# EAGLE design V2a (EAGLE 6.5.0)
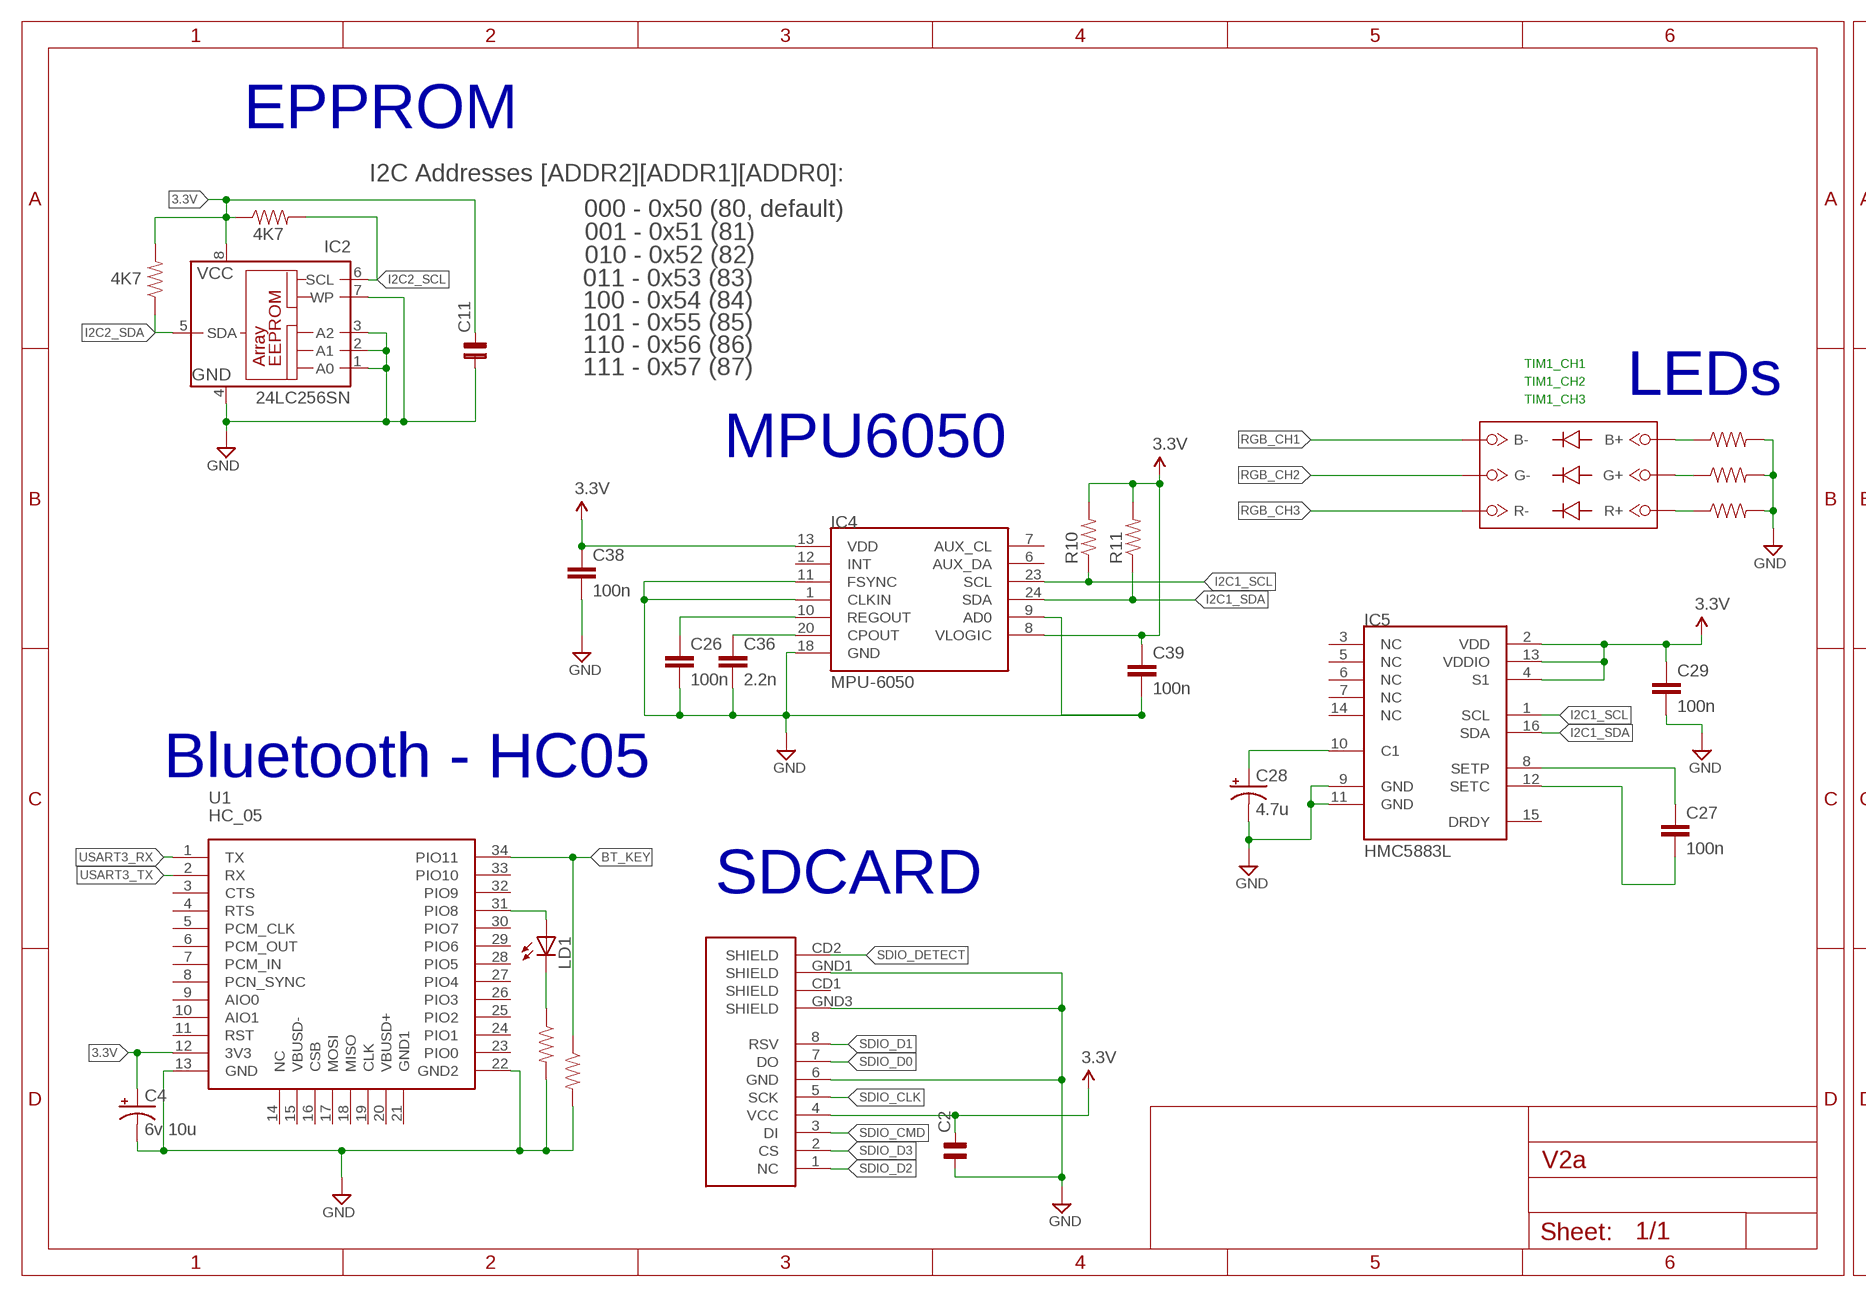
[diagram p0: schematic, sheet 1, part 1 of 2]
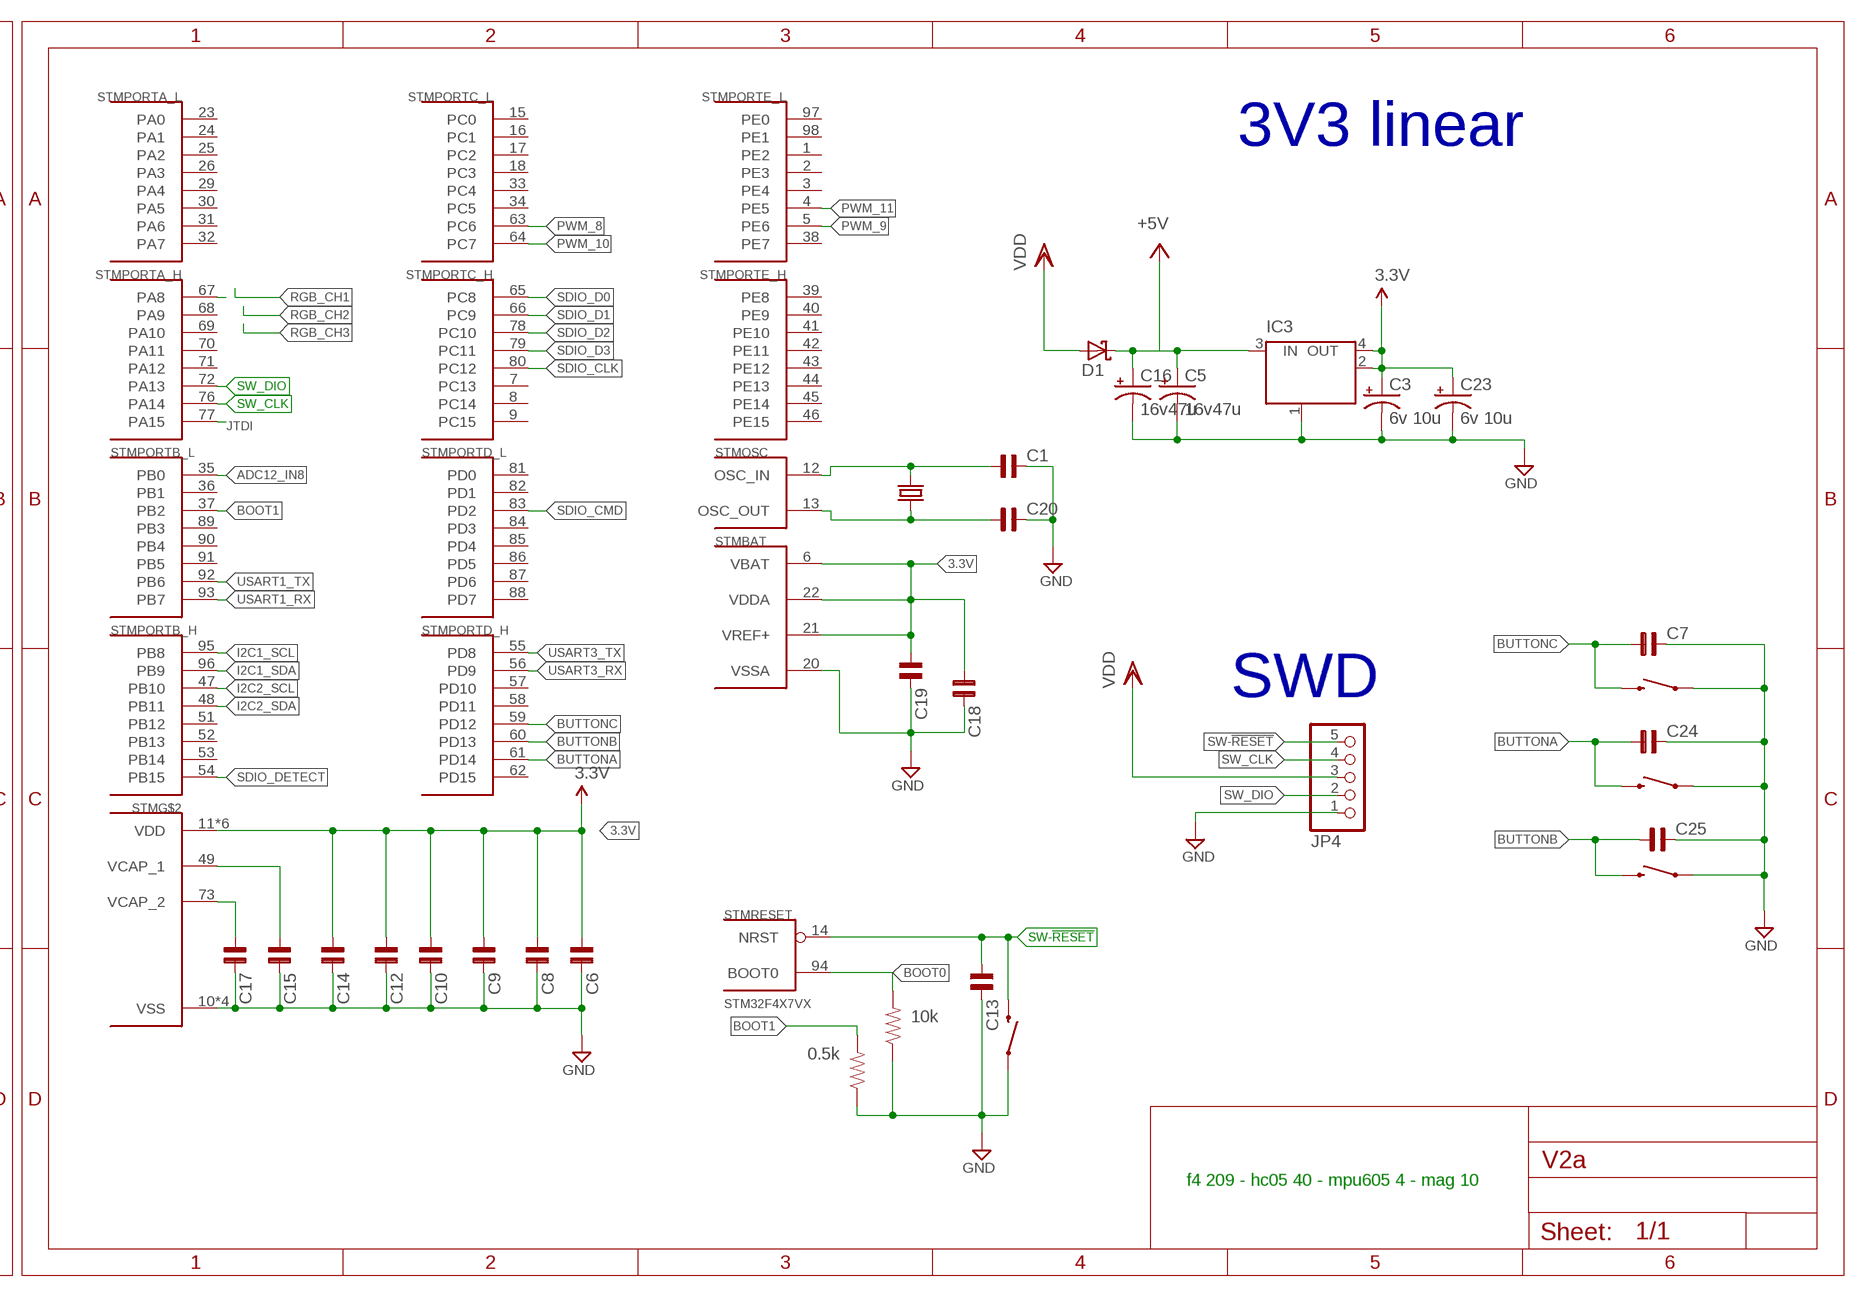
[diagram p1: schematic, sheet 1, part 2 of 2]

## Parts
C1  C-NP-SMD-0603  [C-0603]
C2  C-NP-SMD-0603  [C-0603]
C3  6v 10u  CPOL-USSMCC  [SMC_C]
C4  6v 10u  CPOL-USSMCA  [SMC_A]
C5  16v47u  CPOL-USSMCC  [SMC_C]
C6  C-NP-SMD-0603  [C-0603]
C7  C-NP-SMD-0603  [C-0603]
C8  C-NP-SMD-0603  [C-0603]
C9  C-NP-SMD-0603  [C-0603]
C10  C-NP-SMD-0603  [C-0603]
C11  C-NP-SMD-0603  [C-0603]
C12  C-NP-SMD-0603  [C-0603]
C13  C-NP-SMD-0603  [C-0603]
C14  C-NP-SMD-0603  [C-0603]
C15  C-NP-SMD-0603  [C-0603]
C16  16v47u  CPOL-USSMCC  [SMC_C]
C17  C-NP-SMD-0603  [C-0603]
C18  C-NP-SMD-0603  [C-0603]
C19  C-NP-SMD-0603  [C-0603]
C20  C-NP-SMD-0603  [C-0603]
C23  6v 10u  CPOL-USSMCC  [SMC_C]
C24  C-NP-SMD-0603  [C-0603]
C25  C-NP-SMD-0603  [C-0603]
C26  100n  SPARKFUN_CAP0603-CAP  [SPARKFUN_0603-CAP]
C27  100n  SPARKFUN_CAP0603-CAP  [SPARKFUN_0603-CAP]
C28  4.7u  CPOL-USSMCA  [SMC_A]
C29  100n  SPARKFUN_CAP0603-CAP  [SPARKFUN_0603-CAP]
C36  2.2n  SPARKFUN_CAP0603-CAP  [SPARKFUN_0603-CAP]
C38  100n  SPARKFUN_CAP0603-CAP  [SPARKFUN_0603-CAP]
C39  100n  SPARKFUN_CAP0603-CAP  [SPARKFUN_0603-CAP]
D1  MBRS330T3  [SMC]
IC2  24LC256SN  [SO-08]
IC3  LINEAR_MC33269ST-3.3T3  [LINEAR_SOT223]
IC4  MPU-6050  TESTING_MPU-6050-1  [TESTING_QFN-24-4MM2]
IC5  HMC5883L  SPARKFUN_HMC5883LSMD  [SPARKFUN_16LPCC]
JP4  PINHD-1X5_2.54-90°  [1X05/90]
LD1  LEDCHIPLED_0603  [CHIPLED_0603]
R2  10K  SPARKFUN_RESISTOR0603-RES  [SPARKFUN_0603-RES]
R3  10K  SPARKFUN_RESISTOR0603-RES  [SPARKFUN_0603-RES]
R5  10K  SPARKFUN_RESISTOR0603-RES  [SPARKFUN_0603-RES]
R6  10K  SPARKFUN_RESISTOR0603-RES  [SPARKFUN_0603-RES]
R7  10k  SPARKFUN_RESISTOR0603-RES  [SPARKFUN_0603-RES]
R8  0.5k  SPARKFUN_RESISTOR0603-RES  [SPARKFUN_0603-RES]
R9  10K  SPARKFUN_RESISTOR0603-RES  [SPARKFUN_0603-RES]
R10  SPARKFUN_RESISTOR0603-RES  [SPARKFUN_0603-RES]
R11  SPARKFUN_RESISTOR0603-RES  [SPARKFUN_0603-RES]
R15  4K7  SPARKFUN_RESISTOR0603-RES  [SPARKFUN_0603-RES]
R16  4K7  SPARKFUN_RESISTOR0603-RES  [SPARKFUN_0603-RES]
S1  RESET  SWITCH-MOMENTARY-2-SMD-1101NE  [TACTILE-SWITCH-1101NE]
S2  RESET  SWITCH-MOMENTARY-2-SMD-1101NE  [TACTILE-SWITCH-1101NE]
S3  RESET  SWITCH-MOMENTARY-2-SMD-1101NE  [TACTILE-SWITCH-1101NE]
S4  RESET  SWITCH-MOMENTARY-2-SMD-1101NE  [TACTILE-SWITCH-1101NE]
SDCARD2  microSD Socket  USD-SOCKETNEW  [MICRO-SD-SOCKET-PP]
STM  STM32F4X7VX  [TQFP100]
U1  HC_05  [BLUETOOTH_SMD]
U$12  RGB_LED  [SMD]
Y1  CRYSTALHC49US  [HC49US]

## Nets
3.3V: C2.2 C3.+ C4.+ C6.1 C8.1 C9.1 C10.1 C11.2 C12.1 C14.1 C18.1 C19.1 C23.+ C29.1 C38.1 C39.1 IC2.8(VCC) IC3.2(OUT) IC3.4(OUT) IC4.8(VLOGIC) IC4.13(VDD) IC5.2(VDD) IC5.4(S1) IC5.13(VDDIO) R10.2 R11.2 R15.1 R16.2 SDCARD2.4(VCC) STM.6(BAT:VBAT) STM.11(VDD) STM.19(VDD) STM.21(BAT:VREF+) STM.22(BAT:VDDA) STM.28(VDD) STM.50(VDD) STM.75(VDD) STM.100(VDD) U1.12(3V3)
+5V: C5.+ C16.+ D1.C IC3.3(IN)
ADC12_IN8: STM.35(PORTB_L:PB0)
BOOT0: R7.2 STM.94(RESET:BOOT0)
BOOT1: R8.2 STM.37(PORTB_L:PB2)
BT_KEY: R5.1 U1.34(PIO11)
BUTTONA: C24.1 S3.P$2 STM.61(PORTD_H:PD14)
BUTTONB: C25.1 S2.P$2 STM.60(PORTD_H:PD13)
BUTTONC: C7.1 S4.P$2 STM.59(PORTD_H:PD12)
GND: C1.2 C2.1 C3.- C4.- C5.- C6.2 C7.2 C8.2 C9.2 C10.2 C11.1 C12.2 C13.2 C14.2 C15.2 C16.- C17.2 C18.2 C19.2 C20.2 C23.- C24.2 C25.2 C26.2 C28.- C29.2 C36.2 C38.2 C39.2 IC2.1(A0) IC2.2(A1) IC2.3(A2) IC2.4(GND) IC2.7(WP) IC3.1(GND/ADJ) IC4.1(CLKIN) IC4.9(AD0) IC4.11(FSYNC) IC4.18(GND) IC5.9(GND) IC5.11(GND) JP4.1 R2.2 R3.2 R5.2 R6.2 R7.1 R8.1 R9.2 S1.P$1 S2.P$1 S3.P$1 S4.P$1 SDCARD2.6(GND) SDCARD2.GND1(SHIELD) SDCARD2.GND3(SHIELD) STM.10(VSS) STM.20(BAT:VSSA) STM.27(VSS) STM.74(VSS) STM.99(VSS) U1.13(GND) U1.22(GND2)
I2C1_SCL: IC4.23(SCL) IC5.1(SCL) R10.1 STM.95(PORTB_H:PB8)
I2C1_SDA: IC4.24(SDA) IC5.16(SDA) R11.1 STM.96(PORTB_H:PB9)
I2C2_SCL: IC2.6(SCL) R15.2 STM.47(PORTB_H:PB10)
I2C2_SDA: IC2.5(SDA) R16.1 STM.48(PORTB_H:PB11)
JTDI: STM.77(PORTA_H:PA15)
N$1: C1.1 STM.12(OSC:OSC_IN) Y1.2
N$2: R2.1 U$12.B+
N$3: C26.1 IC4.10(REGOUT)
N$4: LD1.A U1.31(PIO8)
N$5: LD1.C R9.1
N$6: R6.1 U$12.R+
N$7: R3.1 U$12.G+
N$8: C36.1 IC4.20(CPOUT)
N$10: C27.1 IC5.8(SETP)
N$11: STM.67(PORTA_H:PA8)
N$12: C28.+ IC5.10(C1)
N$13: C27.2 IC5.12(SETC)
N$29: C20.1 STM.13(OSC:OSC_OUT) Y1.1
N$31: C17.1 STM.73(VCAP_2)
N$32: C15.1 STM.49(VCAP_1)
PWM_8: STM.63(PORTC_L:PC6)
PWM_9: STM.5(PORTE_L:PE6)
PWM_10: STM.64(PORTC_L:PC7)
PWM_11: STM.4(PORTE_L:PE5)
RGB_CH1: U$12.B-
RGB_CH2: U$12.G-
RGB_CH3: U$12.R-
SDIO_CLK: SDCARD2.5(SCK) STM.80(PORTC_H:PC12)
SDIO_CMD: SDCARD2.3(DI) STM.83(PORTD_L:PD2)
SDIO_D0: SDCARD2.7(DO) STM.65(PORTC_H:PC8)
SDIO_D1: SDCARD2.8(RSV) STM.66(PORTC_H:PC9)
SDIO_D2: SDCARD2.1(NC) STM.78(PORTC_H:PC10)
SDIO_D3: SDCARD2.2(CS) STM.79(PORTC_H:PC11)
SDIO_DETECT: SDCARD2.CD2(SHIELD) STM.54(PORTB_H:PB15)
SW-!RESET: C13.1 JP4.5 S1.P$2 STM.14(RESET:NRST)
SW_CLK: JP4.4 STM.76(PORTA_H:PA14)
SW_DIO: JP4.2 STM.72(PORTA_H:PA13)
USART1_RX: STM.93(PORTB_L:PB7)
USART1_TX: STM.92(PORTB_L:PB6)
USART3_RX: STM.56(PORTD_H:PD9) U1.1(TX)
USART3_TX: STM.55(PORTD_H:PD8) U1.2(RX)
VDD: D1.A JP4.3
Unconnected: IC4.6(AUX_DA) IC4.7(AUX_CL) IC4.12(INT) IC5.3(NC) IC5.5(NC) IC5.6(NC) IC5.7(NC) IC5.14(NC) IC5.15(DRDY) SDCARD2.CD1(SHIELD) STM.1(PORTE_L:PE2) STM.2(PORTE_L:PE3) STM.3(PORTE_L:PE4) STM.7(PORTC_H:PC13) STM.8(PORTC_H:PC14) STM.9(PORTC_H:PC15) STM.15(PORTC_L:PC0) STM.16(PORTC_L:PC1) STM.17(PORTC_L:PC2) STM.18(PORTC_L:PC3) STM.23(PORTA_L:PA0) STM.24(PORTA_L:PA1) STM.25(PORTA_L:PA2) STM.26(PORTA_L:PA3) STM.29(PORTA_L:PA4) STM.30(PORTA_L:PA5) STM.31(PORTA_L:PA6) STM.32(PORTA_L:PA7) STM.33(PORTC_L:PC4) STM.34(PORTC_L:PC5) STM.36(PORTB_L:PB1) STM.38(PORTE_L:PE7) STM.39(PORTE_H:PE8) STM.40(PORTE_H:PE9) STM.41(PORTE_H:PE10) STM.42(PORTE_H:PE11) STM.43(PORTE_H:PE12) STM.44(PORTE_H:PE13) STM.45(PORTE_H:PE14) STM.46(PORTE_H:PE15) STM.51(PORTB_H:PB12) STM.52(PORTB_H:PB13) STM.53(PORTB_H:PB14) STM.57(PORTD_H:PD10) STM.58(PORTD_H:PD11) STM.62(PORTD_H:PD15) STM.68(PORTA_H:PA9) STM.69(PORTA_H:PA10) STM.70(PORTA_H:PA11) STM.71(PORTA_H:PA12) STM.81(PORTD_L:PD0) STM.82(PORTD_L:PD1) STM.84(PORTD_L:PD3) STM.85(PORTD_L:PD4) STM.86(PORTD_L:PD5) STM.87(PORTD_L:PD6) STM.88(PORTD_L:PD7) STM.89(PORTB_L:PB3) STM.90(PORTB_L:PB4) STM.91(PORTB_L:PB5) STM.97(PORTE_L:PE0) STM.98(PORTE_L:PE1) U1.3(CTS) U1.4(RTS) U1.5(PCM_CLK) U1.6(PCM_OUT) U1.7(PCM_IN) U1.8(PCN_SYNC) U1.9(AIO0) U1.10(AIO1) U1.11(RST) U1.14(NC) U1.15(VBUSD-) U1.16(CSB) U1.17(MOSI) U1.18(MISO) U1.19(CLK) U1.20(VBUSD+) U1.21(GND1) U1.23(PIO0) U1.24(PIO1) U1.25(PIO2) U1.26(PIO3) U1.27(PIO4) U1.28(PIO5) U1.29(PIO6) U1.30(PIO7) U1.32(PIO9) U1.33(PIO10)

## Notes on the sheet
- EPPROM | 3V3 linear
- I2C Addresses [ADDR2][ADDR1][ADDR0]:
- 000 - 0x50 (80, default)
- 001 - 0x51 (81)
- 010 - 0x52 (82)
- 011 - 0x53 (83)
- 100 - 0x54 (84)
- 101 - 0x55 (85)
- 110 - 0x56 (86)
- TIM1_CH1
- 111 - 0x57 (87)
- TIM1_CH2
- LEDs
- TIM1_CH3
- MPU6050
- SWD
- Bluetooth - HC05
- SDCARD
- f4 209 - hc05 40 - mpu605 4 - mag 10
- TJA1040

## Library data of the parts
C1 C2 C6-C15 C17-C20 C24 C25 = cap-pan40:C-NP: NON-POLARIZED FILM/CHIP
C3-C5 C16 C23 C28 = rcl:CPOL-US: POLARIZED CAPACITOR, American symbol
C26 C27 C29 C36 C38 C39 = Helios_RLC:SPARKFUN_CAP: Capacitor Standard 0603 ceramic capacitor, and 0.1" leaded capacitor.
D1 = Robotech Diode of Chung:MBRS3*0T3: SCHOTTKY BARRIER RECTIFIER 3.0 AMPERES 20, 30, 40 VOLT Source: MBRS340T3-D.pdf
IC2 = microchip:24*: Serial EEPROM I2C; DIGIKEY: 24LC256-E/SN-ND; MF: MICROCHIP; MPN: 24LC256-I/SN; OC_FARNELL: 9757996; OC_NEWARK: 27C9144
IC3 = Robotech_Other:LINEAR_MC33269ST*: Adjustable Output Low Dropout Voltage Regulator 800 mA Source: http://www.onsemi.com/pub/Collateral/MC33269-D.PDF
IC4 = Helios_IMU:TESTING_MPU-6050
IC5 = Helios_IMU:SPARKFUN_HMC5883L: 3 Axis Digital Compass IC
JP4 = pinhead-1:PINHD-1X5: PIN HEADER
LD1 = led:LED: LED OSRAM: - CHIPLED LG R971, LG N971, LY N971, LG Q971, LY Q971, LO R971, LY R971 LH N974, LH R974 LS Q976, LO Q976, LY Q976 LO Q996 - Hyper CHIPLED LW Q18S LB Q993, LB Q99A, LB R99A - SideLED LS A670, LO A670, LY A670, LG A670, LP A670 LB A673, LV A673, LT A673, LW A673 LH A674 LY A675 LS A676, LA A676, LO A676, LY A676, LW A676 LS A679, LY A679, LG A679 - Hyper Micro SIDELED® LS Y876, LA Y876, LO Y876, LY Y876 LT Y87S - SmartLED LW L88C, LW L88S LB L89C, LB L89S, LG L890 LS L89K, LO L89K, LY L89K LS L896, LA L896, LO L896, LY L896 - TOPLED LS T670, LO T670, LY T670, LG T670, LP T670 LSG T670, LSP T670, LSY T670, LOP T670, LYG T670 LG T671, LOG T671, LSG T671 LB T673, LV T673, LT T673, LW T673 LH T674 LS T676, LA T676, LO T676, LY T676, LB T676, LH T676, LSB T676, LW T676 LB T67C, LV T67C, LT T67C, LS T67K, LO T67K, LY T67K, LW E67C LS E67B, LA E67B, LO E67B, LY E67B, LB E67C, LV E67C, LT E67C LW T67C LS T679, LY T679, LG T679 LS T770, LO T770, LY T770, LG T770, LP T770 LB T773, LV T773, LT T773, LW T773 LH T774 LS E675, LA E675, LY E675, LS T675 LS T776, LA T776, LO T776, LY T776, LB T776 LHGB T686 LT T68C, LB T68C - Hyper Mini TOPLED® LB M676 - Mini TOPLED Santana® LG M470 LS M47K, LO M47K, LY M47K Source: http://www.osram.convergy.de/
R2 R3 R5-R9 R15 R16 = Robotech_RCL:SPARKFUN_RESISTOR: Resistor Basic schematic elements and footprints for 0603, 1206, and PTH resistors.
R10 R11 = Helios_RLC:SPARKFUN_RESISTOR: Resistor Basic schematic elements and footprints for 0603, 1206, and PTH resistors.
S1-S4 = pixhawk2:SWITCH-MOMENTARY-2; PARTNO: EVQ-P7J01P
SDCARD2 = SparkFun:USD-SOCKET: microSD Socket Push-push type uSD socket. Schematic element and footprint production proven. Spark Fun Electronics SKU : PRT-00127. tDoc lines correctly indicate media card edge positions when inserting (unlocked, locked, depressed).
STM = pixhawk2:STM32F4X7VX: STM32F4X7VX 100 pin LQFP STM32F407VE - 512 KB flash, no crypto STM32F407VG - 1 MB flash, no crypto STM32F417VE - 512 KB flash, with crypto STM32F417VG - 1 MB flash, with crypto; PARTNO: STM32F427VI
U1 = SerialPortBluetooth:HC_05
U$12 = RGB_LED:RGB_LED
Y1 = SparkFun-FreqCtrl:CRYSTAL: Various standard crystals. Proven footprints. Spark Fun Electronics SKU : COM-00534

## Net classes
1 power: width 0.15 mm, drill 0.2 mm, clearance 0.152 mm

## Board
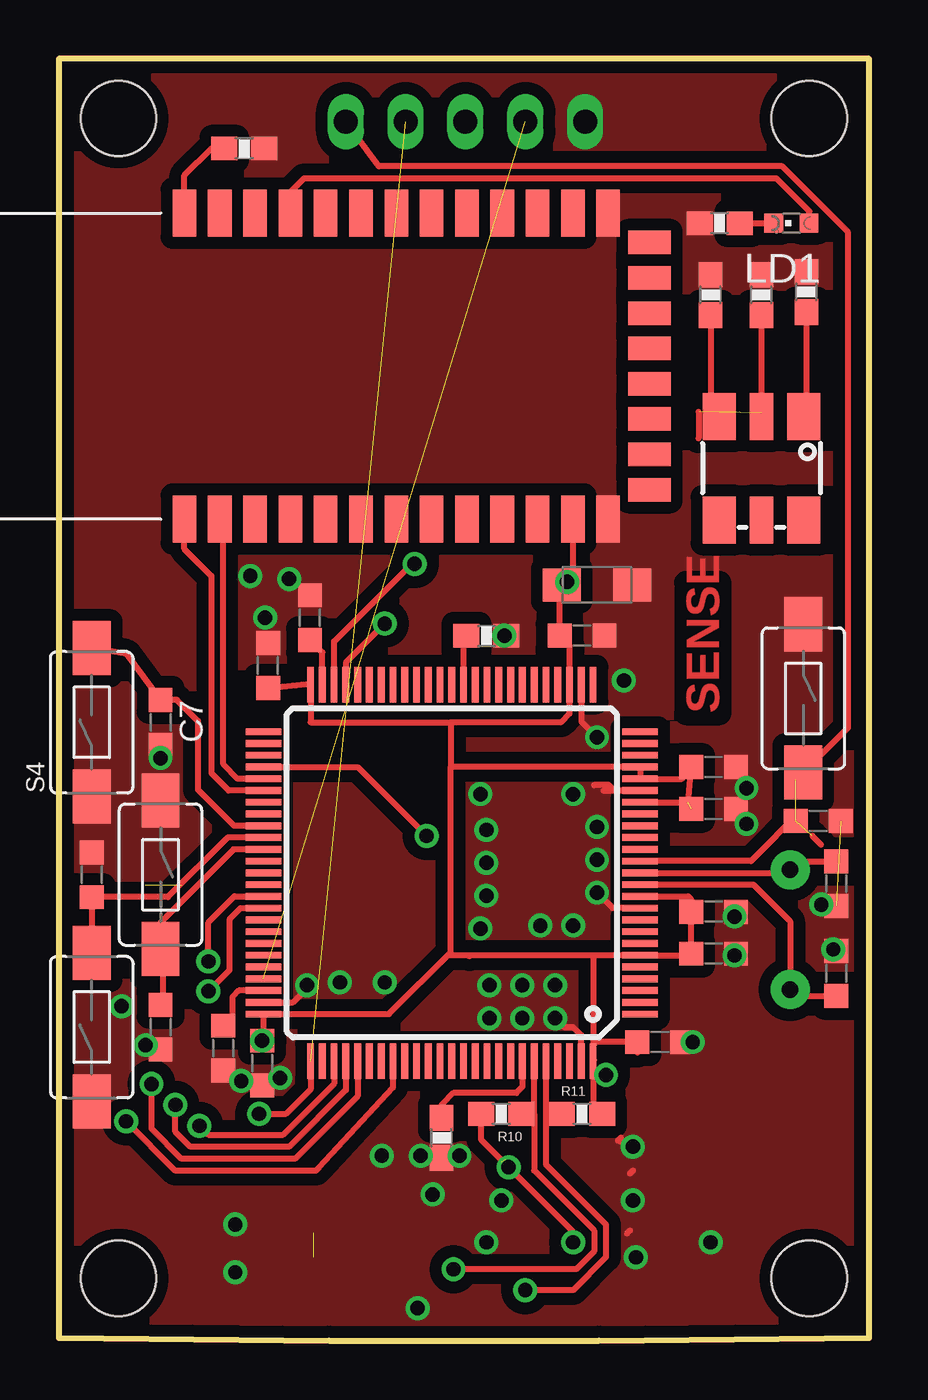
[diagram p2: board, top side]
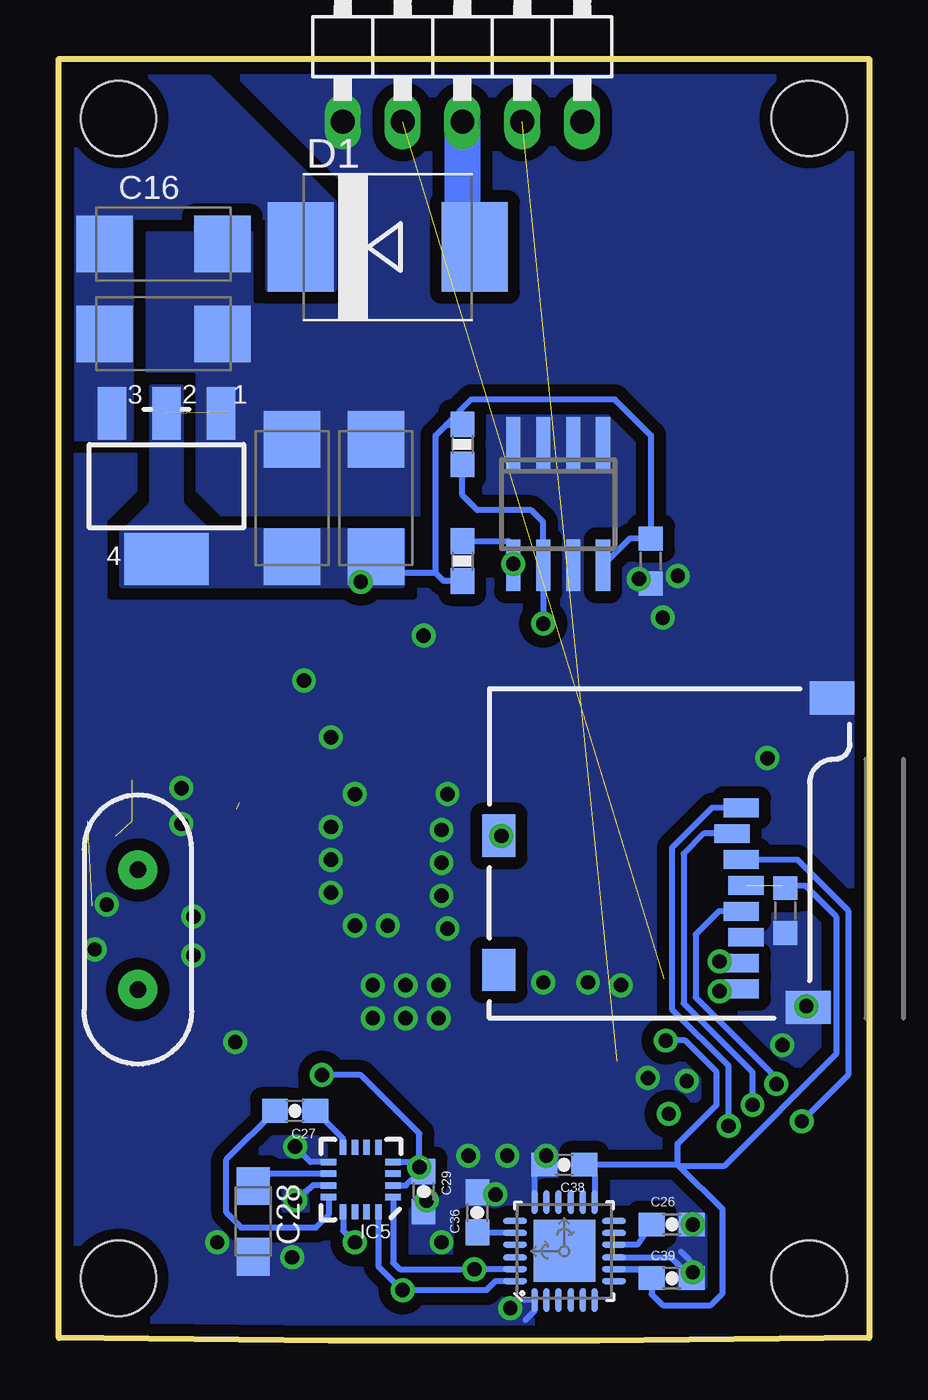
[diagram p3: board, bottom side, seen from below]

Size 34.42 x 54.47 mm. Coordinates in mm from the lower left corner, seen from the top.
Outline: 34.42,54.47 0,54.47 0,0.11 arc2 34.42,0.11 34.42,54.47
Copper layers (1*16): Top 0.035mm / dielectric 1.5mm / Bottom 0.035mm
Design rules "default *": minimum track width 10mil, minimum drill 24mil, track to track 8mil, track to pad 8mil, pad to pad 8mil, via to via 10mil, smd to smd 8mil, copper to edge 20mil, drill to drill 10mil, minimum pad ring 10mil, minimum via ring 8mil, stop-mask expansion 0mil, vias tented up to drill 100mil, thermal gap 10mil
Holes 3.2 mm at 2.54,51.93 31.88,2.65 2.54,2.65 31.88,51.93
tKeepout: area 28.4,-0.8 to 35.4,6.2; area -1,48.4 to 6,55.4; area 28.4,48.4 to 35.4,55.4; area -1,-0.8 to 6,6.2

### Footprints (pad centres in the part's own frame; a part is rotated, then mirrored left to right if it is on the bottom)
C-0603 = smd 1.016 x 1.016: 1 -0.953,0; 2 0.953,0
SMC_C = smd 2.4 x 2.4: + -2.5,0; - 2.5,0
SMC_A = smd 1.6 x 1.4: + -1.5,0; - 1.5,0
SPARKFUN_0603-CAP = smd 1.1 x 1: 1 -0.85,0; 2 0.85,0
SMC = smd 2.8 x 3.8: A 3.7,0; C -3.7,0
SO-08 = smd 0.6 x 2.2: 1 -1.905,-2.6; 2 -0.635,-2.6; 3 0.635,-2.6; 4 1.905,-2.6; 5 1.905,2.6; 6 0.635,2.6; 7 -0.635,2.6; 8 -1.905,2.6
LINEAR_SOT223 = smd 1.219 x 2.235: 1 -2.311,-3.099; 2 0,-3.099; 3 2.311,-3.099 | smd 3.6 x 2.2: 4 0,3.099
TESTING_QFN-24-4MM2 = smd 1.016 x 0.254: 1 -2.066,1.257; 2 -2.066,0.75; 3 -2.066,0.247; 4 -2.066,-0.287; 5 -2.066,-0.792; 6 -2.066,-1.297; 13 2.086,-1.297; 14 2.086,-0.792; 15 2.086,-0.287; 16 2.086,0.247; 17 2.086,0.75; 18 2.086,1.257 | smd 0.254 x 1.016: 7 -1.267,-2.122; 8 -0.762,-2.122; 9 -0.258,-2.122; 10 0.278,-2.122; 11 0.78,-2.122; 12 1.287,-2.122; 19 1.287,2.082; 20 0.78,2.082; 21 0.278,2.082; 22 -0.258,2.082; 23 -0.762,2.082; 24 -1.267,2.082 | smd 2.616 x 2.616: P$1 0.02,-0.01
SPARKFUN_16LPCC = smd 0.65 x 0.28: 1 -1.37,0.75; 2 -1.37,0.25; 3 -1.37,-0.25; 4 -1.37,-0.75; 9 1.37,-0.75; 10 1.37,-0.25; 11 1.37,0.25; 12 1.37,0.75 | smd 0.28 x 0.65: 5 -0.75,-1.37; 6 -0.25,-1.37; 7 0.25,-1.37; 8 0.75,-1.37; 13 0.75,1.37; 14 0.25,1.37; 15 -0.25,1.37; 16 -0.75,1.37
1X05/90 = drill 1.016 long: 1 -5.08,-3.81; 2 -2.54,-3.81; 3 0,-3.81; 4 2.54,-3.81; 5 5.08,-3.81
CHIPLED_0603 = smd 0.8 x 0.8: A 0,-0.75; C 0,0.75
SPARKFUN_0603-RES = smd 1.1 x 1: 1 -0.85,0; 2 0.85,0
TACTILE-SWITCH-1101NE = smd 2.3 x 1.6: P$1 -3.15,0; P$2 3.15,0
MICRO-SD-SOCKET-PP = smd 0.8 x 1.5: 1 -8.94,10.7; 2 -7.84,10.3; 3 -6.74,10.7; 4 -5.64,10.9; 5 -4.54,10.7; 6 -3.44,10.9; 7 -2.34,10.7; 8 -1.24,10.7 | smd 1.8 x 1.4: CD1 -2.05,0.4; CD2 -7.75,0.4 | smd 1.4 x 1.9: GND1 -13.6,14.55; GND3 -0.45,13.55
TQFP100 = smd 1.5 x 0.29: 1 -8,6; 2 -8,5.5; 3 -8,5; 4 -8,4.5; 5 -8,4; 6 -8,3.5; 7 -8,3; 8 -8,2.5; 9 -8,2; 10 -8,1.5; 11 -8,1; 12 -8,0.5; 13 -8,0; 14 -8,-0.5; 15 -8,-1; 16 -8,-1.5; 17 -8,-2; 18 -8,-2.5; 19 -8,-3; 20 -8,-3.5; 21 -8,-4; 22 -8,-4.5; 23 -8,-5; 24 -8,-5.5; 25 -8,-6; 51 8,-6; 52 8,-5.5; 53 8,-5; 54 8,-4.5; 55 8,-4; 56 8,-3.5; 57 8,-3; 58 8,-2.5; 59 8,-2; 60 8,-1.5; 61 8,-1; 62 8,-0.5; 63 8,0; 64 8,0.5; 65 8,1; 66 8,1.5; 67 8,2; 68 8,2.5; 69 8,3; 70 8,3.5; 71 8,4; 72 8,4.5; 73 8,5; 74 8,5.5; 75 8,6 | smd 0.29 x 1.5: 26 -6,-8; 27 -5.5,-8; 28 -5,-8; 29 -4.5,-8; 30 -4,-8; 31 -3.5,-8; 32 -3,-8; 33 -2.5,-8; 34 -2,-8; 35 -1.5,-8; 36 -1,-8; 37 -0.5,-8; 38 0,-8; 39 0.5,-8; 40 1,-8; 41 1.5,-8; 42 2,-8; 43 2.5,-8; 44 3,-8; 45 3.5,-8; 46 4,-8; 47 4.5,-8; 48 5,-8; 49 5.5,-8; 50 6,-8; 76 6,8; 77 5.5,8; 78 5,8; 79 4.5,8; 80 4,8; 81 3.5,8; 82 3,8; 83 2.5,8; 84 2,8; 85 1.5,8; 86 1,8; 87 0.5,8; 88 0,8; 89 -0.5,8; 90 -1,8; 91 -1.5,8; 92 -2,8; 93 -2.5,8; 94 -3,8; 95 -3.5,8; 96 -4,8; 97 -4.5,8; 98 -5,8; 99 -5.5,8; 100 -6,8
BLUETOOTH_SMD = smd 2 x 1: 1 0,0; 2 0,-1.5; 3 0,-3; 4 0,-4.5; 5 0,-6; 6 0,-7.5; 7 0,-9; 8 0,-10.5; 9 0,-12; 10 0,-13.5; 11 0,-15; 12 0,-16.5; 13 0,-18; 22 13,-18; 23 13,-16.5; 24 13,-15; 25 13,-13.5; 26 13,-12; 27 13,-10.5; 28 13,-9; 29 13,-7.5; 30 13,-6; 31 13,-4.5; 32 13,-3; 33 13,-1.5; 34 13,0 | smd 1 x 1.8: 14 1.25,-19.75; 15 2.75,-19.75; 16 4.25,-19.75; 17 5.75,-19.75; 18 7.25,-19.75; 19 8.75,-19.75; 20 10.25,-19.75; 21 11.75,-19.75
SMD = smd 1.99 x 1.4: B+ -2.2,-1.8; B- 2.2,-1.8; R+ -2.2,1.8; R- 2.2,1.8 | smd 1.99 x 1: G+ -2.2,0; G- 2.2,0
HC49US = drill 0.7 pad 1.651: 1 -2.54,0; 2 2.54,0

### Placement (x,y rotation side)
C1  33.02,15.61 90 top
C2  3.56,18.28 90 bottom
C3  24.51,35.8 90 bottom
C4  22.86,32.12 0 top
C5  29.97,42.79 0 bottom
C6  27.81,24.37 0 top
C7  4.32,26.28 270 top
C8  27.81,22.59 0 top
C9  27.81,18.22 0 top
C10  27.81,16.45 0 top
C11  9.27,33.13 90 bottom
C12  25.53,12.69 0 top
C13  32.26,22.09 0 top
C14  22.22,29.96 0 top
C15  10.67,30.72 90 top
C16  29.97,46.6 0 bottom
C17  6.98,12.43 270 top
C18  8.89,28.69 90 top
C19  8.64,11.8 270 top
C20  33.02,19.42 270 top
C23  20.95,35.8 90 bottom
C24  4.32,13.32 270 top
C25  1.4,19.8 90 top
C26  8.38,4.94 0 bottom
C27  24.38,9.77 180 bottom
C28  26.16,5.07 270 bottom
C29  18.92,6.34 270 bottom
C36  16.64,5.45 90 bottom
C38  12.95,7.48 180 bottom
C39  8.38,2.65 0 bottom
D1  20.45,46.47 0 bottom
IC2  13.21,35.55 180 bottom
IC3  29.84,36.31 180 bottom
IC4  12.95,3.8 90 bottom
IC5  21.59,6.85 180 bottom
JP4  17.27,55.61 0 bottom
LD1  31.11,47.49 90 top
R2  27.69,44.44 90 top
R3  29.84,44.44 90 top
R5  7.87,50.66 0 top
R6  31.75,44.56 90 top
R7  16.26,8.62 90 top
R8  18.16,29.96 180 top
R9  28.07,47.49 180 top
R10  18.8,9.64 180 top
R11  22.22,9.64 0 top
R15  17.27,38.09 270 bottom
R16  17.27,33.13 270 bottom
S1  31.62,27.29 270 top
S2  1.4,13.32 90 top
S3  4.32,19.8 270 top
S4  1.4,26.28 90 top
SDCARD2  16.13,13.7 270 bottom
STM  16.69,19.88 180 top
U1  5.33,34.91 90 top
U$12  29.84,37.07 270 top
Y1  31.06,17.47 270 bottom

### Tracks (layer width: path | path; a pad name or v marks a point on that pad's centre or on a via)
3.3V  (via drill 0.61)  (4 unrouted)
  Top 0.254: STM.19 26.73,22.88 C6.1 26.46,23.88 STM.21 STM.22 16.64,24.38 | C10.1 26.86,16.51 | 26.86,16.51 C9.1 26.86,18.75 26.73,18.88 STM.11 | STM.100 22.74,11.93 | 26.86,16.51 26.73,16.38 STM.6 22.69,16.38 | 22.69,16.38 22.69,12.56 | 22.69,12.56 STM.100 | 16.64,16.5 16.64,16.38 17.4,16.38 | 16.64,16.5 16.64,24.38 | 22.69,16.38 17.4,16.38 | 16.64,26.28 10.69,26.28 STM.50 10.69,27.93 C18.1 | 16.64,26.28 16.64,24.38 | 16.64,26.28 21.34,26.28 21.69,26.63 STM.28 21.69,29.54 C14.1 21.27,31.61 | 16.64,16.5 14.02,13.88 STM.75 8.69,12.81 | 27.18,39.47 27.18,38.34 | 22.69,12.56 22.82,12.69 C12.1 24.57,12.24 | 8.69,12.81 8.69,12.68 C19.1 8.69,12.81 | 17.44,16.34 17.4,16.38 | 21.27,31.61 21.27,31.93 v21.59,32.25 21.59,32.09 C4.+ | U1.12 21.83,32.17 21.27,31.61 | R11.2 22.69,10.02 22.69,11.29 | STM.100 22.69,11.29 | v21.84,4.18 21.84,4.63 v19.1,7.37 17.95,8.53 R10.2 | v23.24,11.29 22.69,11.29
  Bottom 0.254: IC4.13 11.66,7.03 C38.1 8.13,7.48 | 19.06,7.63 19.2,7.6 19.2,7.47 v19.1,7.37 | 19.06,7.63 C29.1 v19.1,7.37 | IC5.2 19.68,6.6 19.18,7.1 arc-90 19.1,7.17 v19.1,7.37 | 9.27,2.65 9.65,3.04 IC4.8 9.87,3.04 C39.1 9.23,1.98 8.76,1.51 6.73,1.51 6.22,2.02 6.22,5.58 8.06,7.42 | 8.06,7.42 8.13,7.48 | 18.99,7.7 19.06,7.63 | C2.2 3.67,19.34 2.72,19.34 1.4,18.02 1.4,12.18 6.16,7.42 8.06,7.42 | IC5.4 18.8,7.6 | R16.2 18.07,32.28 18.41,32.63 | 18.41,32.63 18.41,38.47 17.95,38.94 | 17.95,38.94 R15.1 | 17.95,38.94 16.89,39.99 10.8,39.99 9.27,38.47 C11.2 10.16,34.09 IC2.8 | IC5.13 22.34,4.67 v21.84,4.18 | 8.13,7.48 8.13,8.37 6.48,10.02 6.48,11.42 7.81,12.75 C19.1 | v19.1,7.37 19.1,8.8 21.59,11.29 v23.24,11.29 | 18.41,32.63 20.95,32.63 | 20.95,32.63 C23.+ | v21.59,32.25 20.95,32.25 20.95,32.63
  other vias: 8.64,12.75
  pour Bottom (isolate 0.508, no thermals): 19.81,34.4 28.07,34.4 29.21,35.55 29.21,40.5 30.48,40.5 30.48,35.55 31.75,34.28 31.75,32.12 19.81,32.12
+5V
  pour Bottom (isolate 0.508, no thermals): 31.37,38.34 33.78,38.34 33.78,47.74 33.66,47.74 33.66,53.84 28.19,53.84 22.73,48.37 22.73,44.69 25.53,44.69 25.53,47.74 31.37,47.74
BOOT0
  Top 0.254: STM.94 19.69,10.79 19.43,10.53 16.76,10.53 16.26,10.02 R7.2
BOOT1
  Top 0.254: STM.37 17.19,29.57 R8.2
BT_KEY
  Top 0.254: U1.34 5.33,49.52 6.48,50.66 R5.1
BUTTONA
  Top 0.254: C24.1 4.45,14.66 4.45,17.01 4.32,16.88 S3.P$2 4.32,17.77 7.43,20.88 STM.61
BUTTONB
  Top 0.254: S2.P$2 C25.1 4.64,18.85 7.17,21.38 STM.60
BUTTONC
  Top 0.254: S4.P$2 2.88,29.17 C7.1 5.02,27.23 5.91,26.34 5.91,23.42 7.45,21.88 STM.59
GND  (via drill 0.61)  (2 unrouted)
  Top 0.254: 22.73,23.61 23.37,23.61 23.6,23.38 STM.20 23.14,23.38 | STM.27 22.19,26.31 v22.86,25.64 | STM.74 9.95,14.38 10.54,14.97 | STM.99 22.19,12.98 21.84,13.32 21.46,13.32 v21.08,13.7 | STM.10 23.52,18.38 v22.86,19.04 | v24.38,8.24 23.75,8.5 23.88,8.62 | 24.26,7.1 24.38,7.23 | 24.26,4.69 24.13,4.56
  Bottom 0.254: 8,3.79 7.62,3.42 7.62,2.74 C39.2 8.42,3.54 IC4.9 | IC4.18 14.21,7.48 C38.2 | IC5.9 23.74,7.6 v24.38,8.24 | IC5.11 23.62,6.6 v24.38,5.96 | 14.64,1.73 IC4.1 14.21,1.27 14.6,0.88
  other vias: 24,28.05 18.16,21.7 18.16,20.31 18.16,18.91 17.91,17.51 20.45,17.64 21.84,17.64 22.86,21.83 22.86,20.43 17.91,23.23 21.84,23.23 10.54,15.1 18.29,15.1 21.08,15.1 19.68,15.1 18.29,13.7 19.68,13.7 26.92,12.69 29.21,23.48 29.21,21.96 28.7,18.02 28.7,16.37 9.4,11.16 24.51,3.54 18.8,5.96 15.88,6.21 7.49,4.94 7.49,2.91 18.92,29.96 32.38,18.53 32.89,16.62 11.94,15.23 13.84,15.23 7.75,11.04 18.16,4.18 15.37,7.86 13.72,7.86 27.69,4.18 15.24,1.38 17.02,7.86 2.67,14.21 3.68,12.56 4.32,24.75 9.78,32.37 8.76,30.72 8.13,32.5
  pour Top (isolate 0.508, rank 6, no thermals): 16,76.31 -13.72,76.31 -12.83,-26.17 44.7,-26.17 43.81,62.73
  pour Bottom (isolate 0.508, rank 6, no thermals): 15.24,60.57 47.62,60.57 63.63,-31 -15.11,-31 -15.11,70.35 15.24,70.35
I2C1_SCL  (via drill 0.61)
  Top 0.254: 20.19,9.64 20.19,7.23 22.73,4.69 22.73,3.8 21.97,3.04 v16.76,3.04 | R10.1 20.19,9.64 | 20.19,9.64 STM.95
  Bottom 0.254: IC4.23 | IC4.23 v16.76,3.04 19.94,3.04 20.22,3.32 IC5.1
I2C1_SDA  (via drill 0.61)
  Top 0.254: 21.34,9.64 21.21,9.47 | 21.21,9.47 R11.1 | STM.96 20.69,9.64 | 20.69,9.64 20.69,7.49 23.24,4.94 23.24,3.54 21.84,2.15 v19.81,2.15 | 21.21,9.47 21.21,9.64 20.69,9.64
  Bottom 0.254: IC5.16 20.84,3.16 19.82,2.15 v19.81,2.15 16.26,2.15 15.87,2.53 IC4.24
I2C2_SCL  (via drill 0.61)
  Top 0.254: STM.47 12.19,28.82 v13.84,30.47
  Bottom 0.254: R15.2 17.27,35.93 16.64,35.29 14.35,35.29 13.84,34.79 IC2.6 v13.84,30.47
I2C2_SDA  (via drill 0.61)
  Top 0.254: STM.48 11.69,29.71 14.99,33.01 v15.11,33.01
  Bottom 0.254: R16.1 15.33,33.98 15.11,33.77 IC2.5 v15.11,33.01
N$1
  Top 0.254: STM.12 29.5,19.38 31.06,17.82 Y1.2 31.33,14.66 C1.1
N$2
  Top 0.254: R2.1 27.69,39.5 U$12.B+
N$3
  Bottom 0.254: C26.1 9.84,4.08 IC4.10
N$4
  Top 0.254: U1.31 9.83,48.81 10.41,49.39 30.48,49.39 31.88,47.99 31.88,47.5 LD1.A
N$5
  Top 0.254: R9.1 LD1.C
N$6
  Top 0.254: R6.1 31.75,39.5 U$12.R+
N$7
  Top 0.254: R3.1 29.84,39.23 29.59,38.98 29.84,38.98 30.1,39.23 29.76,39.23 U$12.G+
N$8
  Bottom 0.254: IC4.20 16.62,4.58 C36.1
N$10
  Bottom 0.254: IC5.8 22.34,8.57 C27.1
N$12
  Bottom 0.254: IC5.10 25.43,7.1 C28.+
N$13
  Bottom 0.254: IC5.12 22.96,5.35 23.49,4.81 26.67,4.81 27.3,5.45 27.3,7.7 C27.2
N$29
  Top 0.254: C20.1 31.43,20.37 Y1.1 30.93,19.88 STM.13
N$31
  Top 0.254: STM.73 7.65,14.88 7.37,14.59 7.37,13.39 C17.1
N$32
  Top 0.254: STM.49 11.19,29.25 C15.1
SDIO_CLK  (via drill 0.61)
  Top 0.254: STM.80 12.69,10.39 10.03,7.73 5.21,7.73 3.94,9 v3.94,10.91
  Bottom 0.254: SDCARD2.5 6.38,18.24 7.37,17.26 7.37,14.59 3.94,11.16 v3.94,10.91
SDIO_CMD  (via drill 0.61)
  Top 0.254: STM.83 14.19,10.75 11.05,7.35 10.92,7.23 4.95,7.23 v2.86,9.32
  Bottom 0.254: SDCARD2.3 3.06,20.44 0.89,18.28 0.89,11.29 v2.86,9.32
SDIO_D0  (via drill 0.61)
  Top 0.254: STM.65 7.46,18.88 6.35,17.77 v6.35,16.12
  Bottom 0.254: SDCARD2.7 6.28,16.04 v6.35,16.12
SDIO_D1  (via drill 0.61)
  Top 0.254: STM.66 7.72,18.38 7.24,17.89 7.24,15.74 v6.35,14.85
  Bottom 0.254: v6.35,14.85 5.53,14.85 SDCARD2.8
SDIO_D2  (via drill 0.61)
  Top 0.254: v5.97,9.13 6.35,8.75 9.52,8.75 11.69,10.92 STM.78
  Bottom 0.254: SDCARD2.1 6.68,22.64 8.38,20.94 8.38,14.08 5.97,11.67 v5.97,9.13
SDIO_D3  (via drill 0.61)
  Top 0.254: STM.79 12.19,10.65 9.78,8.24 5.59,8.24 4.95,8.88 v4.95,10.02
  Bottom 0.254: SDCARD2.2 7.02,21.54 7.87,20.69 7.87,14.34 4.95,11.42 v4.95,10.02
SDIO_DETECT  (via drill 0.61)
  Top 0.254: STM.54 12.69,24.38 v15.62,21.45
  Bottom 0.254: v15.62,21.45 15.75,21.47 SDCARD2.CD2
SW-!RESET  (2 unrouted)
  Top 0.254: STM.14 29.41,20.38 30.48,21.45 30.48,21.48 31.09,22.09 C13.1 | 32,21.45 32.38,21.07 | 31.3,23.82 S1.P$2 33.53,26.05 33.53,47.1 30.73,49.9 13.59,49.9 JP4.5
SW_CLK  (via drill 0.61)  (1 unrouted)
  Top 0.254: STM.76 10.69,10.68 9.65,9.64 v8.51,9.64
SW_DIO  (1 unrouted)
USART3_RX
  Top 0.254: STM.56 7.22,23.38 6.48,24.12 6.48,32.5 5.33,33.64 U1.1
USART3_TX
  Top 0.254: STM.55 7.6,23.88 6.98,24.5 6.98,34.66 arc90 6.6,35.04 6.71,35.04 arc-90 U1.2
VDD
  Bottom 1.524: JP4.3 17.27,46.99 D1.A

### Text on the board
Top: vnd241092@gmail.com | SENSE
tNames: 0 | 1 | RX | TX | 2 | 3 | 4 | 5 | 6 | 7 | 8 | 9 | 10 | 11